# Altium schematic sheet 1 040 1573.rev01_reg.SchDoc
size A4; SheetNumber: 3; SheetTotal: 5
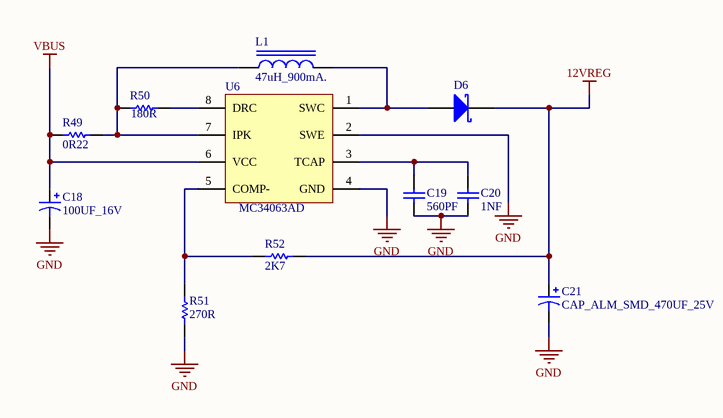
[diagram p0: 1 040 1573.rev01_reg.SchDoc]

## Parts
C18  100UF_16V  [0505(47uF/35V)]
C19  560PF  [Capacitor(0603)-1]
C20  1NF  [Capacitor(0603)-1]
C21  CAP_ALM_SMD_470UF_25V  [0505(470uF/25V)]
D6  DIODE_SCHOTTKY_50V_3A_DO214AA_SR35  [SMB_0]  (value not drawn)
L1  47uH_900mA.  [SMD_inductor(900mA)]
R49  0R22  [Resistor(0805) -1]
R50  180R  [Resistor(0603) -1]
R51  270R  [Resistor(0603) -1]
R52  2K7  [Resistor(0603) -1]
U6  MC34063AD  [SO-8]

## Nets
12VREG: C21.1 D6.2(K) R52.2
GND: C18.2 C19.1 C20.1 C21.2 R51.1 U6.2(SWE) U6.4(GND)
VBUS: C18.1 R49.1 U6.6(VCC)
NetC19_2: C19.2 C20.2 U6.3(TCAP)
NetD6_1: D6.1(A) L1.2 U6.1(SWC)
NetL1_1: L1.1 R49.2 R50.1 U6.7(IPK)
NetR50_2: R50.2 U6.8(DRC)
NetR51_2: R51.2 R52.1 U6.5(COMP-)

## Library data of the parts
C18 = CAP_ALM_SMD_100UF_16V_1: 1 043 0020; Published: 8-Jun-2000; LatestRevisionDate: 17-Jul-2002; LatestRevisionNote: Re-released for DXP Platform.; PackageReference: POLAR0.8; Publisher: Altium Limited; Stok Kodu: 1 043 0020
C19 = CAP_CER_SMD_560PF_50V_0603: 1 043 0220; Published: 8-Jun-2000; LatestRevisionDate: 17-Jul-2002; LatestRevisionNote: Re-released for DXP Platform.; PackageReference: RAD-0.3; Publisher: Altium Limited; Stok Kodu: 1 043 0220
C20 = CAP_CER_SMD_1NF_50V_0603: 1 043 0109; Published: 8-Jun-2000; LatestRevisionDate: 17-Jul-2002; LatestRevisionNote: Re-released for DXP Platform.; PackageReference: RAD-0.3; Publisher: Altium Limited; Stok Kodu: 1 043 0109
C21 = CAP_ALM_SMD_470UF_25V: 1 043 0043; Published: 8-Jun-2000; LatestRevisionDate: 17-Jul-2002; LatestRevisionNote: Re-released for DXP Platform.; PackageReference: RAD-0.3; Publisher: Altium Limited; Stok Kodu: 1 043 0043
D6 = DIODE_SCHOTTKY_50V_3A_DO214AA_SR35: 1 044 0063; Published: 8-Jun-2000; LatestRevisionDate: 17-Jul-2002; LatestRevisionNote: Re-released for DXP Platform.; PackageReference: SMB; Publisher: Altium Limited; Code_JEDEC: DO-214-AA; Stok Kodu: 1 044 0063
L1 = 47uH_900mA. Coil: 1 048 0071
R49 = RES_SMD_0R22_%5_0805: 1 042 0614; Published: 8-Jun-2000; LatestRevisionDate: 17-Jul-2002; LatestRevisionNote: Re-released for DXP Platform.; PackageReference: AXIAL-0.3; Publisher: Altium Limited; Stok Kodu: 1 042 0614
R50 = RES_SMD_180R_%5_0603: 1 042 0558; Published: 8-Jun-2000; LatestRevisionDate: 17-Jul-2002; LatestRevisionNote: Re-released for DXP Platform.; PackageReference: AXIAL-0.3; Publisher: Altium Limited; Stok Kodu: 1 042 0558
R51 = RES_SMD_270R_%1_0603: 1 042 0622; Published: 8-Jun-2000; LatestRevisionDate: 17-Jul-2002; LatestRevisionNote: Re-released for DXP Platform.; PackageReference: AXIAL-0.3; Publisher: Altium Limited; Stok Kodu: 1 042 0622
R52 = RES_SMD_2K7_%1_0603: 1 042 0625; Published: 8-Jun-2000; LatestRevisionDate: 17-Jul-2002; LatestRevisionNote: Re-released for DXP Platform.; PackageReference: AXIAL-0.3; Publisher: Altium Limited; Stok Kodu: 1 042 0625
U6 = IC_REG_SMD_SOIC8_TI_MC34063AD: 1 046 0094 (UTC); PartNumber: MC34063ADR; Manufacturer: Texas Instruments; Duty Cycle(Max)(%): 90; Rating: Catalog; Eco-Plan: Green (RoHS & no Sb/Br); Switch Current Limit(Typ)(A): 1.5; Iq(Typ)(mA): 4; Regulated Outputs(#): 1; Vin(Max)(V): 40; SubFamily: Step-Down Regulator; Topology: Buck, Inverting Buck-Boost; Vin(Min)(V): 3; Iout(Max)(A): 0.75; Vout(Min)(V): 1.55; Mounting Technology: Surface Mount; ComponentLink2Description: Package Specification; PackageDescription: 8-Pin Plastic Small Outline Integrated Circuit, 4.9 x 3.9 mm, Pitch 1.27 mm Pitch; ComponentLink3Description: URL Link1; DatasheetVersion: SLLS636M; ComponentLink1URL: http://www.ti.com/general/docs/lit/getliterature.tsp?genericPartNumber=MC34063A&fileType=pdf; Code_JEDEC: MS-012AA; ComponentLink2URL: http://www.ti.com/litv/pdf/msoi002j; ComponentLink3URL: Samples URL:http://www.ti.com/product/mc34063a#samples; PackageVersion: revM, Jun-2011; Vout(Max)(V): 40; PackageReference: D0008A; ComponentLink1Description: Datasheet; Stok Kodu: 1 046 0094 (UTC); Manufacturer Product Number: MC34063AD